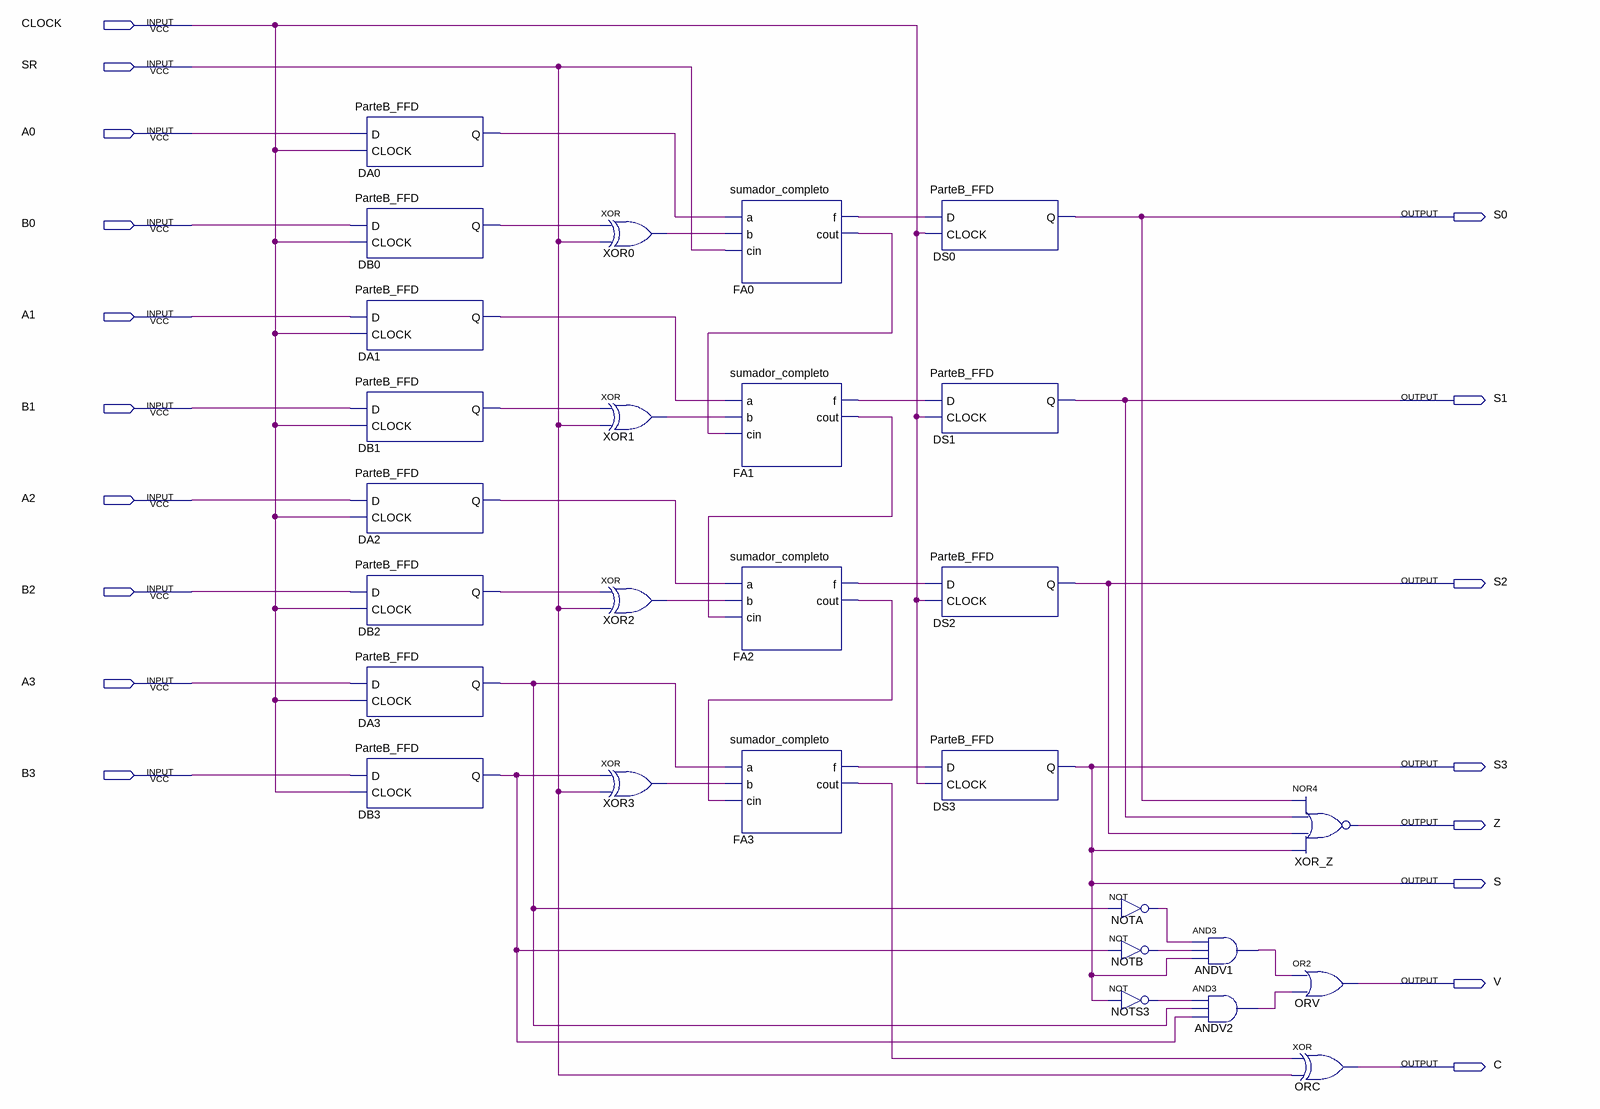
[diagram p0: schematic sheet]
// Quartus schematic Block1.bdf as structural Verilog: 28 symbols, 18 pins
module Block1 (
  input  CLOCK,
  input  SR,
  input  A0,
  input  B0,
  input  A1,
  input  B1,
  input  A2,
  input  B2,
  input  A3,
  input  B3,
  output S0,
  output S1,
  output S2,
  output S3,
  output Z,
  output S,
  output V,
  output C
);

  wire ANDV1_out, ANDV2_out, DA0_q, DA1_q, DA2_q, DA3_q, DB0_q, DB1_q, DB2_q, DB3_q, FA0_cout, FA0_f,
       FA1_cout, FA1_f, FA2_cout, FA2_f, FA3_cout, FA3_f, NOTA_out, NOTB_out, NOTS3_out, XOR0_out, XOR1_out,
       XOR2_out, XOR3_out;

  ParteB_FFD DA0 (.D(A0), .CLOCK(CLOCK), .Q(DA0_q));
  ParteB_FFD DB0 (.D(B0), .CLOCK(CLOCK), .Q(DB0_q));
  ParteB_FFD DA1 (.D(A1), .CLOCK(CLOCK), .Q(DA1_q));
  ParteB_FFD DB1 (.D(B1), .CLOCK(CLOCK), .Q(DB1_q));
  ParteB_FFD DA2 (.D(A2), .CLOCK(CLOCK), .Q(DA2_q));
  ParteB_FFD DB2 (.D(B2), .CLOCK(CLOCK), .Q(DB2_q));
  ParteB_FFD DA3 (.D(A3), .CLOCK(CLOCK), .Q(DA3_q));
  ParteB_FFD DB3 (.D(B3), .CLOCK(CLOCK), .Q(DB3_q));
  xor XOR0 (XOR0_out, DB0_q, SR);
  xor XOR1 (XOR1_out, DB1_q, SR);
  xor XOR2 (XOR2_out, DB2_q, SR);
  xor XOR3 (XOR3_out, DB3_q, SR);
  sumador_completo FA0 (.a(DA0_q), .b(XOR0_out), .cin(SR), .f(FA0_f), .cout(FA0_cout));
  sumador_completo FA1 (.a(DA1_q), .b(XOR1_out), .cin(FA0_cout), .f(FA1_f), .cout(FA1_cout));
  sumador_completo FA2 (.a(DA2_q), .b(XOR2_out), .cin(FA1_cout), .f(FA2_f), .cout(FA2_cout));
  sumador_completo FA3 (.a(DA3_q), .b(XOR3_out), .cin(FA2_cout), .f(FA3_f), .cout(FA3_cout));
  ParteB_FFD DS0 (.D(FA0_f), .CLOCK(CLOCK), .Q(S0));
  ParteB_FFD DS1 (.D(FA1_f), .CLOCK(CLOCK), .Q(S1));
  ParteB_FFD DS2 (.D(FA2_f), .CLOCK(CLOCK), .Q(S2));
  ParteB_FFD DS3 (.D(FA3_f), .CLOCK(CLOCK), .Q(S));
  not NOTA (NOTA_out, DA3_q);
  not NOTB (NOTB_out, DB3_q);
  not NOTS3 (NOTS3_out, S);
  and ANDV1 (ANDV1_out, NOTA_out, NOTB_out, S);
  and ANDV2 (ANDV2_out, NOTS3_out, DA3_q, DB3_q);
  nor XOR_Z (Z, S0, S1, S2, S);
  or ORV (V, ANDV1_out, ANDV2_out);
  xor ORC (C, FA3_cout, SR);

  assign S3 = S;
endmodule
